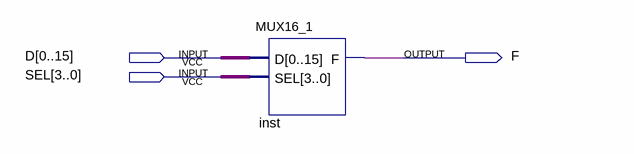
[diagram p0: schematic sheet]
// Quartus schematic lab4-mux16_1.bdf as structural Verilog: 1 symbols, 3 pins
module \lab4-mux16_1  (
  input  [0:15] D,
  input  [3:0] SEL,
  output F
);

  MUX16_1 inst (.D(D), .SEL(SEL), .F(F));
endmodule
